# EAGLE design 8But (EAGLE 6.5.0)
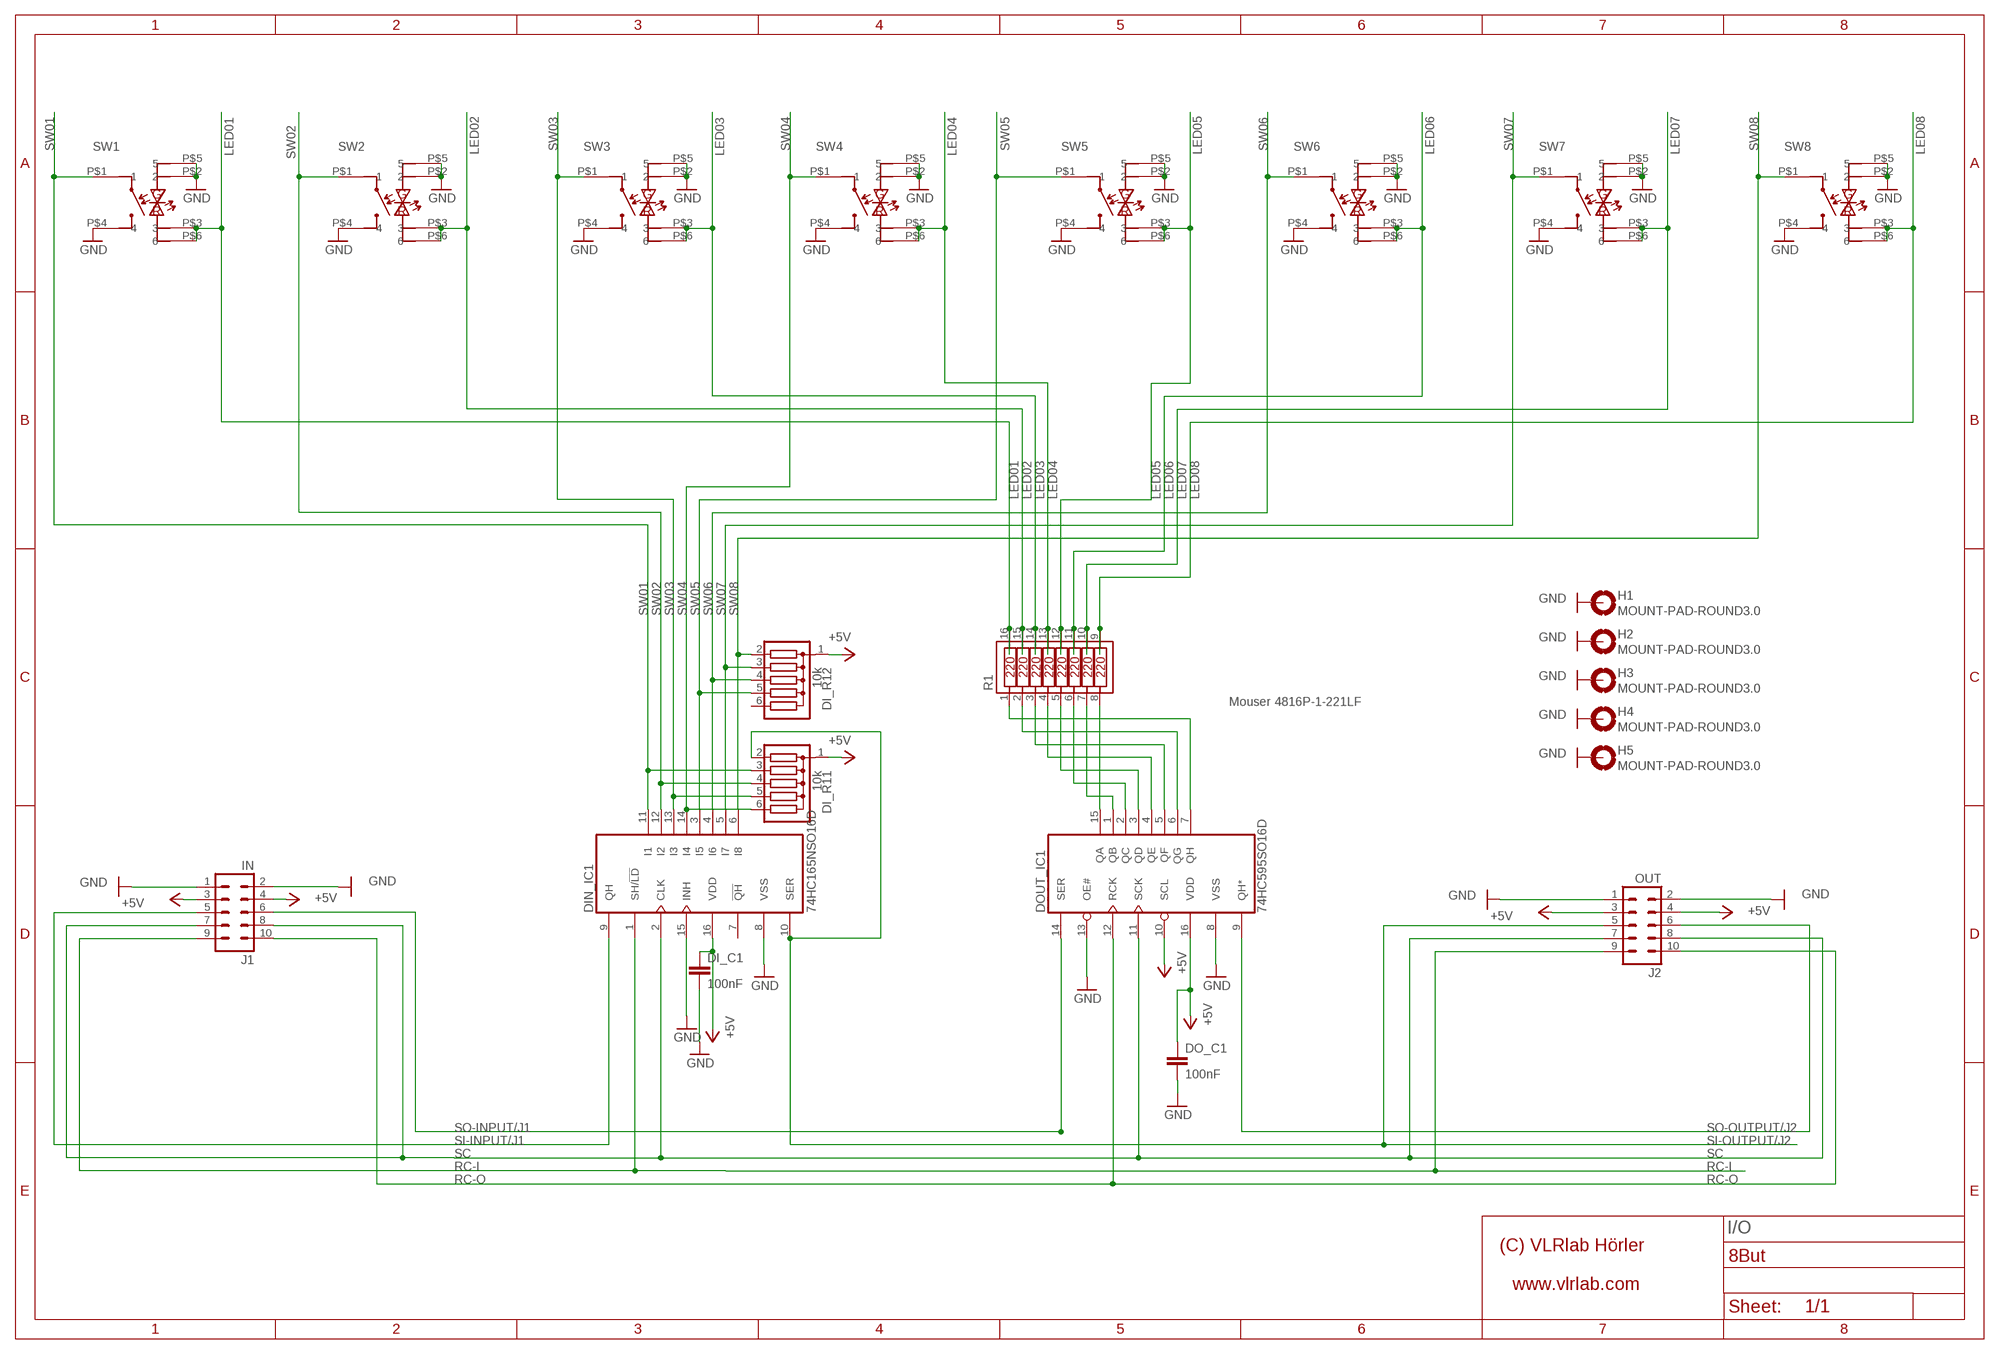
[diagram p0: schematic, sheet 1]

## Parts
DI_C1  100nF  C5/3  [C5B3]
DI_R11  10k  4306R  [SIL6]
DI_R12  10k  4306R  [SIL6]
DIN_IC1  74HC165NSO16D  [SO16D]
DO_C1  100nF  C5/3  [C5B3]
DOUT_IC1  74HC595SO16D  [SO16D]
H1  MOUNT-PAD-ROUND3.0  [3,0-PAD]
H2  MOUNT-PAD-ROUND3.0  [3,0-PAD]
H3  MOUNT-PAD-ROUND3.0  [3,0-PAD]
H4  MOUNT-PAD-ROUND3.0  [3,0-PAD]
H5  MOUNT-PAD-ROUND3.0  [3,0-PAD]
J1  IN  ML10  [ML10]
J2  OUT  ML10  [ML10]
R1  4816P-1SOIC16W  [SOIC16W]
SW1  COMB_G3+G5  [COMB_G3+G5]
SW2  COMB_G3+G5  [COMB_G3+G5]
SW3  COMB_G3+G5  [COMB_G3+G5]
SW4  COMB_G3+G5  [COMB_G3+G5]
SW5  COMB_G3+G5  [COMB_G3+G5]
SW6  COMB_G3+G5  [COMB_G3+G5]
SW7  COMB_G3+G5  [COMB_G3+G5]
SW8  COMB_G3+G5  [COMB_G3+G5]

## Nets
+5V [VDD]: DI_C1.1 DI_R11.1 DI_R12.1 DIN_IC1.16(VDD) DO_C1.1 DOUT_IC1.10(SCL) DOUT_IC1.16(VDD) J1.3 J1.4 J2.3 J2.4
GND: DI_C1.2 DIN_IC1.8(VSS) DIN_IC1.15(INH) DO_C1.2 DOUT_IC1.8(VSS) DOUT_IC1.13(OE#) H1.B3,0(MOUNT) H2.B3,0(MOUNT) H3.B3,0(MOUNT) H4.B3,0(MOUNT) H5.B3,0(MOUNT) J1.1 J1.2 J2.1 J2.2 SW1.P$2 SW1.P$4 SW1.P$5 SW2.P$2 SW2.P$4 SW2.P$5 SW3.P$2 SW3.P$4 SW3.P$5 SW4.P$2 SW4.P$4 SW4.P$5 SW5.P$2 SW5.P$4 SW5.P$5 SW6.P$2 SW6.P$4 SW6.P$5 SW7.P$2 SW7.P$4 SW7.P$5 SW8.P$2 SW8.P$4 SW8.P$5
LED01: R1.16 SW1.P$3 SW1.P$6
LED02: R1.15 SW2.P$3 SW2.P$6
LED03: R1.14 SW3.P$3 SW3.P$6
LED04: R1.13 SW4.P$3 SW4.P$6
LED05: R1.12 SW5.P$3 SW5.P$6
LED06: R1.11 SW6.P$3 SW6.P$6
LED07: R1.10 SW7.P$3 SW7.P$6
LED08: R1.9 SW8.P$3 SW8.P$6
N$1: DOUT_IC1.15(QA) R1.8
N$2: DOUT_IC1.1(QB) R1.7
N$3: DOUT_IC1.2(QC) R1.6
N$4: DOUT_IC1.3(QD) R1.5
N$5: DOUT_IC1.4(QE) R1.4
N$6: DOUT_IC1.5(QF) R1.3
N$7: DOUT_IC1.6(QG) R1.2
N$8: DOUT_IC1.7(QH) R1.1
RC-I: DIN_IC1.1(SH/!LD) J1.9 J2.9
RC-O: DOUT_IC1.12(RCK) J1.10 J2.10
SC: DIN_IC1.2(CLK) DOUT_IC1.11(SCK) J1.7 J1.8 J2.7 J2.8
SI-INPUT/J1: DIN_IC1.9(QH) J1.5
SI-OUTPUT/J2: DI_R11.2 DIN_IC1.10(SER) J2.5
SO-INPUT/J1: DOUT_IC1.14(SER) J1.6
SO-OUTPUT/J2: DOUT_IC1.9(QH*) J2.6
SW01: DI_R11.3 DIN_IC1.11(I1) SW1.P$1
SW02: DI_R11.4 DIN_IC1.12(I2) SW2.P$1
SW03: DI_R11.5 DIN_IC1.13(I3) SW3.P$1
SW04: DI_R11.6 DIN_IC1.14(I4) SW4.P$1
SW05: DI_R12.5 DIN_IC1.3(I5) SW5.P$1
SW06: DI_R12.4 DIN_IC1.4(I6) SW6.P$1
SW07: DI_R12.3 DIN_IC1.5(I7) SW7.P$1
SW08: DI_R12.2 DIN_IC1.6(I8) SW8.P$1
Unconnected: DI_R12.6 DIN_IC1.7(!QH)

## Notes on the sheet
- Mouser 4816P-1-221LF
- I/O

## Library data of the parts
DI_C1 DO_C1 = capacitor-wima:C: CAPACITOR naming: grid - package width
DI_R11 DI_R12 = Bourns Resistor Array:4306R
DIN_IC1 = 595-541-165-uln2803:74HC165N
DOUT_IC1 = 595-541-165-uln2803:74HC595
H1-H5 = holes:MOUNT-PAD-ROUND: MOUNTING PAD, round
J1 J2 = con-harting-ml:ML10: HARTING; OC_FARNELL: unknown; OC_NEWARK: unknown
R1 = Bourns Resistor Array:4816P-1
SW1-SW8 = Mec Switches:COMB_G3+G5: This Package contains a Symbol for combining G3&G5 Switches from MEC. !!!Important!!! To make a G3 Switch work you have to cut Pin 1&3 off.

## Net classes
0 default: width 0.254 mm, drill 0.33 mm, clearance 0.355 mm
1 VDD: width 0.61 mm, drill 0.33 mm, clearance 0.355 mm to class 0, clearance 0.355 mm

## Board
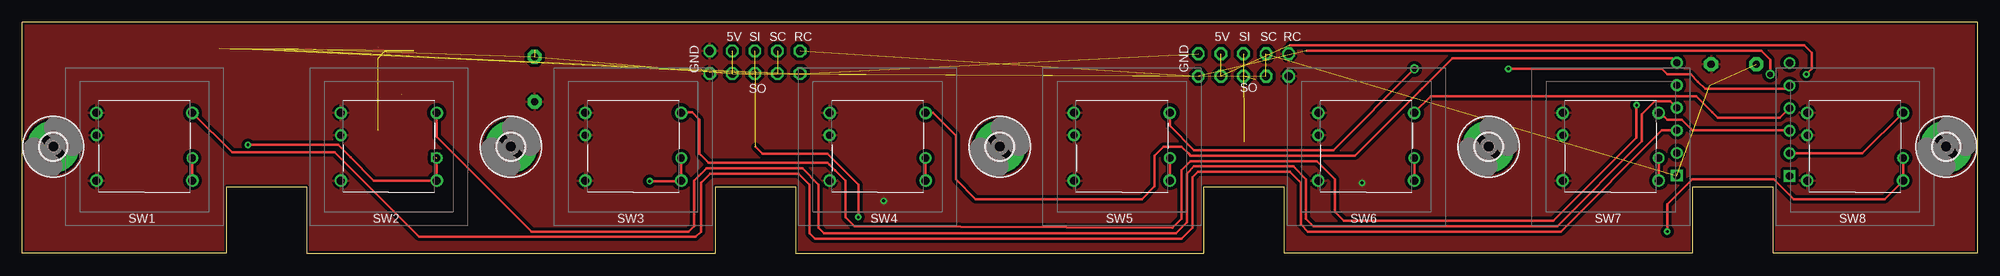
[diagram p1: board, top side]
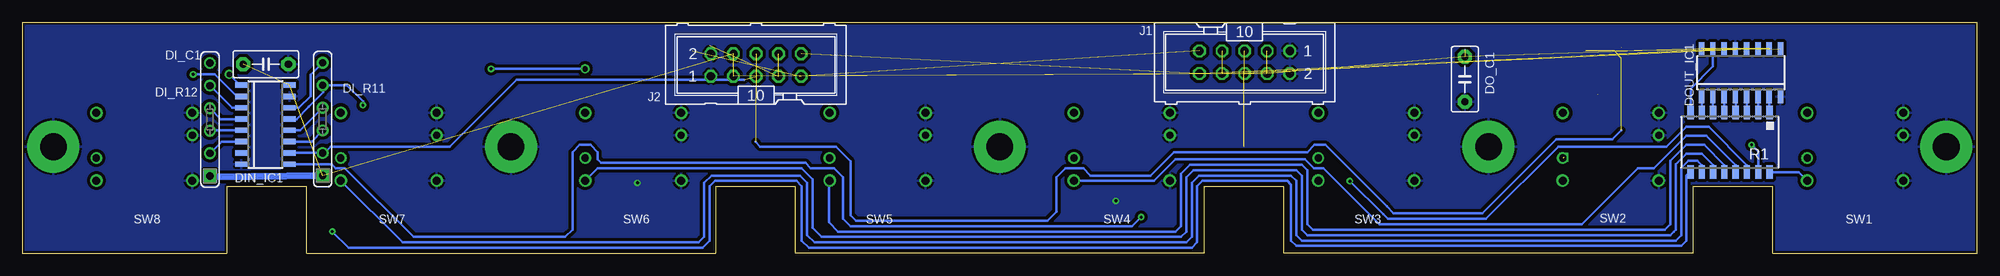
[diagram p2: board, bottom side, seen from below]

Size 220 x 26 mm. Coordinates in mm from the lower left corner, seen from the top.
Outline: 32,0 78,0 78,7.5 87,7.5 87,0 133,0 133,7.5 142,7.5 142,0 188,0 188,7.5 197,7.5 197,0 220,0 220,26 0,26 0,0 23,0 23,7.5 32,7.5 32,0
Copper layers (1*16): Top 0.035mm / dielectric 1.5mm / Bottom 0.035mm
Design rules "makePCB *": minimum track width 10mil, minimum drill 24mil, track to track 8mil, track to pad 8mil, pad to pad 8mil, via to via 8mil, smd to smd 8mil, copper to edge 10mil, drill to drill 8mil, minimum pad ring 10mil, minimum via ring 8mil, stop-mask expansion 4mil, vias tented up to drill 0mil, thermal gap 10mil
vRestrict: area 127.3,8.6 to 147.6,24.9; area 72.1,8.6 to 92.7,24.9

### Footprints (pad centres in the part's own frame; a part is rotated, then mirrored left to right if it is on the bottom)
C5B3 = drill 0.813 pad 1.6 octagon: 1 -2.54,0; 2 2.54,0
SIL6 = drill 0.813 square: 1 -6.35,0 | drill 0.813: 2 -3.81,0; 3 -1.27,0; 4 1.27,0; 5 3.81,0; 6 6.35,0
SO16D = smd 0.6 x 1.4: 1 -4.481,-2.764; 2 -3.211,-2.764; 3 -1.941,-2.764; 4 -0.671,-2.764; 5 0.599,-2.764; 6 1.869,-2.764; 7 3.139,-2.764; 8 4.409,-2.764; 9 4.409,2.666; 10 3.139,2.666; 11 1.869,2.666; 12 0.599,2.666; 13 -0.671,2.666; 14 -1.941,2.666; 15 -3.211,2.666; 16 -4.481,2.666
3,0-PAD = drill 3 pad 5.842: B3,0 0,0
ML10 = drill 0.914 octagon: 1 -5.08,-1.27; 2 -5.08,1.27; 3 -2.54,-1.27; 4 -2.54,1.27; 5 0,-1.27; 6 0,1.27; 7 2.54,-1.27; 8 2.54,1.27; 9 5.08,-1.27; 10 5.08,1.27
SOIC16W = smd 0.7 x 1.5: 1 -4.445,-3.346; 2 -3.175,-3.346; 3 -1.905,-3.346; 4 -0.635,-3.346; 5 0.635,-3.346; 6 1.905,-3.346; 7 3.175,-3.346; 8 4.445,-3.346; 9 4.445,3.346; 10 3.175,3.346; 11 1.905,3.346; 12 0.635,3.346; 13 -0.635,3.346; 14 -1.905,3.346; 15 -3.175,3.346; 16 -4.445,3.346
COMB_G3+G5 = drill 0.9: P$1 5.4,3.81; P$2 -5.4,3.81; P$3 5.4,-3.81; P$4 -5.4,-3.81 | drill 0.8: P$5 -5.4,1.278; P$6 5.4,-1.278

### Placement (x,y rotation side)
DI_C1  192.59,21.28 0 bottom
DI_R11  186.19,15.1 90 bottom
DI_R12  198.87,15.06 90 bottom
DIN_IC1  192.58,14.44 270 bottom
DO_C1  57.66,19.59 270 bottom
DOUT_IC1  26.55,20.37 0 bottom
H1  3.5,12 0 top
H2  55,12 0 top
H3  110,12 0 top
H4  165,12 0 top
H5  216.5,12 0 top
J1  82.45,21.5 180 bottom
J2  137.43,21.19 0 bottom
R1  27.83,12.49 180 bottom
SW1  13.75,12 0 top
SW2  41.25,12 0 top
SW3  68.75,12 0 top
SW4  96.25,12 0 top
SW5  123.75,12 0 top
SW6  151.25,12 0 top
SW7  178.75,12 0 top
SW8  206.25,12 0 top
U$1  [VLRLAB]  2,21 0 top
U$3  [8BUT]  2,1 0 top
U$4  [8BUT]  22,1 0 bottom
U$5  [VLRLAB]  121.06,18.4 0 bottom

### Tracks (layer width: path | path; a pad name or v marks a point on that pad's centre or on a via)
+5V  (10 unrouted)
  Bottom 0.813: DI_R11.1 198.26,8.55 DI_R12.1 | DO_C1.1 57.66,22.59 57.66,21.71
GND  (via drill 0.33)  (2 unrouted)
  other vias: 150.77,7.92 96.93,5.89
  pour Bottom: 0,26 220,26 220,0 197,0 197,7.5 188,7.5 188,0 142,0 142,7.5 133,7.5 133,0 87,0 87,7.5 78,7.5 78,0 32,0 32,7.5 23,7.5 23,0 0,0
  pour Top: 0,26 220,26 220,0 197,0 197,7.5 188,7.5 188,0 142,0 142,7.5 133,7.5 133,0 87,0 87,7.5 78,7.5 78,0 32,0 32,7.5 23,7.5 23,0 0,0
LED01
  Top 0.254: SW1.P$6 SW1.P$3
  Bottom 0.254: SW1.P$3 20.11,9.15 R1.16
LED02  (via drill 0.33, 0.6)  (1 unrouted)
  Top 0.254: v25.4,12.19 26.92,12.19 35.56,12.19 36.97,10.79 39.56,8.19 SW2.P$3 SW2.P$6
  Bottom 0.254: v25.4,12.19 24.65,11.45 R1.15
  other vias: 46.53,10.79
LED03  (via drill 0.33)
  Top 0.254: v70.61,8.13 74.09,8.13 SW3.P$3 SW3.P$6
  Bottom 0.254: R1.14 25.91,9.16 25.91,9.91 30.23,14.22 32.77,14.22 34.98,12.01 47.14,12.01 55.27,3.88 66.34,3.88 66.85,4.37 v70.61,8.13
LED04
  Top 0.254: SW4.P$6 SW4.P$3
  Bottom 0.254: SW4.P$3 101.6,8.14 92.66,8.14 90.22,10.58 75.64,10.58 74.62,9.57 73.56,9.57 67.26,3.27 44.5,3.27 38.2,9.57 36.41,9.57 32.77,13.21 30.48,13.21 27.18,9.91 27.18,9.16 R1.13
LED05
  Top 0.254: SW5.P$6 SW5.P$3
  Bottom 0.254: SW5.P$3 129.24,8.11 129.24,3.47 128.22,2.45 96.93,2.45 90.22,2.45 89.61,3.06 89.61,8.96 88.59,9.97 76,9.97 75.39,9.36 75.39,3.27 74.78,2.66 35.15,2.66 34.54,3.27 34.54,3.67 34.54,8.96 34.54,10.41 32.77,12.19 30.73,12.19 28.45,9.91 28.45,9.16 R1.12
LED06
  Top 0.254: SW6.P$6 SW6.P$3
  Bottom 0.254: SW6.P$3 155.27,9.57 132.28,9.57 131.06,8.35 131.06,2.86 130.05,1.84 97.13,1.84 89.61,1.84 89,2.45 89,8.55 88.19,9.36 76.61,9.36 76,8.75 76,2.66 75.39,2.05 34.54,2.05 34.14,2.45 33.93,2.66 33.93,8.55 33.93,10.01 32.77,11.18 30.99,11.18 29.72,9.91 29.72,9.16 R1.11
LED07
  Top 0.254: SW7.P$6 SW7.P$3
  Bottom 0.254: SW7.P$3 177.19,1.24 143.87,1.24 143.26,1.84 143.26,7.94 142.44,8.75 132.49,8.75 131.67,7.94 131.67,2.05 130.86,1.24 96.93,1.24 89,1.24 88.39,1.84 88.39,7.94 87.58,8.75 77.22,8.75 76.61,8.14 76.61,2.05 76,1.44 33.93,1.44 33.33,2.05 33.33,8.14 33.33,9.6 32.51,10.41 31.5,10.41 30.99,9.91 30.99,9.16 R1.10
LED08  (via drill 0.33)
  Top 0.254: SW8.P$6 SW8.P$3 209.57,6.11 199.34,6.11 197.1,8.35 187.96,8.35 185.12,5.5 v185.12,2.45
  Bottom 0.254: v185.12,2.45 183.29,0.63 183.08,0.63 143.46,0.63 142.65,1.44 142.65,7.53 142.04,8.14 132.89,8.14 132.28,7.53 132.28,1.44 131.47,0.63 96.93,0.63 88.39,0.63 87.78,1.24 87.78,7.53 87.17,8.14 77.62,8.14 77.22,7.74 77.22,1.44 76.61,0.83 33.33,0.83 32.72,1.44 32.72,7.74 32.72,8.7 R1.9
N$1
  Bottom 0.254: DOUT_IC1.15 29.76,21.04 32.26,18.54 32.26,15.85 R1.8
N$2
  Bottom 0.254: DOUT_IC1.1 31,17.58 R1.7
N$3
  Bottom 0.254: DOUT_IC1.2 29.73,17.58 R1.6
N$4
  Bottom 0.254: DOUT_IC1.3 28.46,17.58 R1.5
N$5
  Bottom 0.254: DOUT_IC1.4 27.19,17.58 R1.4
N$6
  Bottom 0.254: DOUT_IC1.5 25.92,17.58 R1.3
N$7
  Bottom 0.254: DOUT_IC1.6 24.65,17.58 R1.2
N$8
  Bottom 0.254: DOUT_IC1.7 23.38,17.58 R1.1
RC-I  (via drill 0.61)  (2 unrouted)
  Top 0.254: v196.7,20.13 196.7,21.76 195.68,22.77 144.58,22.77
  Bottom 0.254: DIN_IC1.1 195.49,18.92 v196.7,20.13
RC-O  (2 unrouted)
SC  (via drill 0.33)  (5 unrouted)
  Top 0.254: v200.76,20.13 201.37,20.74 201.37,22.57 200.56,23.38 142.65,23.38
  Bottom 0.254: DIN_IC1.2 195.84,17.65 198.32,20.13 v200.76,20.13
SI-INPUT/J1  (via drill 0.33 pad 0.61)  (3 unrouted)
  Top 0.254: v94.08,4.08 94.08,7.74 90.63,11.19 83.31,11.19 82.5,12.01
  Bottom 0.254: DIN_IC1.9 185.17,10.03 184.71,9.57 183.69,9.57 175.97,1.84 158.9,1.84 158.09,2.66 158.09,11.39 157.28,12.21 156.06,12.21 155.25,11.39 155.25,10.58 154.84,10.18 131.88,10.18 131.27,9.57 128.63,9.57 127.61,8.55 127.61,3.88 126.8,3.06 95.1,3.06 v94.08,4.08
SI-OUTPUT/J2  (1 unrouted)
  Bottom 0.254: DIN_IC1.10 DI_R11.2 186.03,11.29 185.32,12.01 171.91,12.01 164.39,19.52 138.75,19.52
SO-INPUT/J1  (1 unrouted)
SO-OUTPUT/J2  (5 unrouted)
  Bottom 0.254: 137.5,12.55 136.96,12.01 128.42,12.01 126.8,10.38 126.8,4.28 126.19,3.67 104.65,3.67 103.63,4.69 103.63,8.55 102.62,9.57 100.58,9.57 99.77,8.75 99.57,8.75 99.16,8.75 93.07,8.75 90.42,11.39 75.39,11.39 74.57,12.21 73.36,12.21 66.45,5.3 65.68,4.49 55.68,4.49 47.35,12.82 41.05,12.82 40.03,13.83
SW01
  Top 0.254: DI_R11.3 184.5,13.83 173.13,2.45 144.68,2.45 143.87,3.27 143.87,7.94 142.65,9.16 132.28,9.16 131.67,8.55 131.67,2.86 130.45,1.64 89.2,1.64 88.59,2.25 88.59,7.74 87.38,8.96 77.42,8.96 76.4,7.94 76.4,2.45 75.79,1.84 44.65,1.84 35.15,11.34 23.62,11.34 SW1.P$1
  Bottom 0.254: DIN_IC1.11 187.45,12.57 DI_R11.3
SW02
  Top 0.254: SW2.P$1 46.65,13.11 57.3,2.45 74.98,2.45 75.59,3.06 75.59,8.14 77.01,9.57 87.78,9.57 89.61,7.74 89.61,2.86 90.22,2.25 129.84,2.25 131.06,3.47 131.06,8.96 131.88,9.77 143.05,9.77 144.47,8.35 144.47,3.88 145.29,3.06 172.72,3.06 182.27,12.61 182.27,15.66 183.69,17.09 185.48,17.09 DI_R11.4
  Bottom 0.254: DIN_IC1.12 188.72,13.84 DI_R11.4
SW03  (via drill 0.33 pad 0.61)
  Top 0.254: SW3.P$1 74.21,15.87 75.39,15.87 76.2,15.05 76.2,11.19 77.22,10.18 90.63,10.18 90.83,9.97 91.44,9.36 92.66,8.14 92.66,4.08 93.67,3.06 129.44,2.86 130.45,3.88 130.45,9.36 131.47,10.38 145.49,10.38 145.69,10.38 147.73,8.35 147.73,4.69 148.74,3.67 172.31,3.67 181.66,13.02 181.66,15.87 v181.66,16.68
  Bottom 0.254: DIN_IC1.13 189.12,15.11 187.76,16.48 186.13,18.1 186.13,18.86 DI_R11.5 183.49,18.91 181.66,17.09 v181.66,16.68
SW04
  Top 0.254: SW4.P$1 102.47,15.81 105.05,13.22 105.05,8.35 107.29,6.11 125.98,6.11 127.41,7.53 127.41,10.99 128.42,12.01 130.45,12.01 131.27,11.19 131.47,10.99 149.96,10.99 157.28,18.3 157.48,18.51 160.93,21.96 185.68,21.96 DI_R11.6
  Bottom 0.254: DIN_IC1.14 188.87,16.38 187.55,17.69 187.55,20.09 DI_R11.6
SW05  (via drill 0.33 pad 0.61, 0.6 pad 0.61)
  Top 0.254: SW5.P$1 129.15,14.32 131.88,11.6 147.52,11.6 v156.67,20.74 | v167.23,20.74 184.51,20.74 185.12,20.13 187.76,20.13 188.57,19.32 189.38,18.51 198.51,18.51 DI_R12.5
  Bottom 0.254: DIN_IC1.3 196.39,16.38 DI_R12.5 | v156.67,20.74 v167.23,20.74
SW06
  Top 0.254: SW6.P$1 156.65,15.85 158.5,17.69 182.68,17.69 182.88,17.69 188.37,17.69 190.19,15.87 190.81,15.26 197.8,15.26 DI_R12.4
  Bottom 0.254: DIN_IC1.4 197.66,15.11 DI_R12.4
SW07
  Top 0.254: SW7.P$1 184.36,15.81 185.12,15.05 186.74,15.05 187.76,14.04 187.96,13.83 198.83,13.83 DI_R12.3
  Bottom 0.254: DIN_IC1.5 198.82,13.84 DI_R12.3
SW08
  Top 0.254: DI_R12.2 207.09,11.25 SW8.P$1
  Bottom 0.254: DIN_IC1.6 197.55,12.57 DI_R12.2

### Text on the board
tNames: 5V | SI | SC | RC | 5V | SI | SC | RC | GND | GND | SO | SO
bNames: SW1 | SW2 | SW3 | SW4 | SW5 | SW6 | SW7 | SW8